# EAGLE design servopoinB-2 (EAGLE 6.6.0)
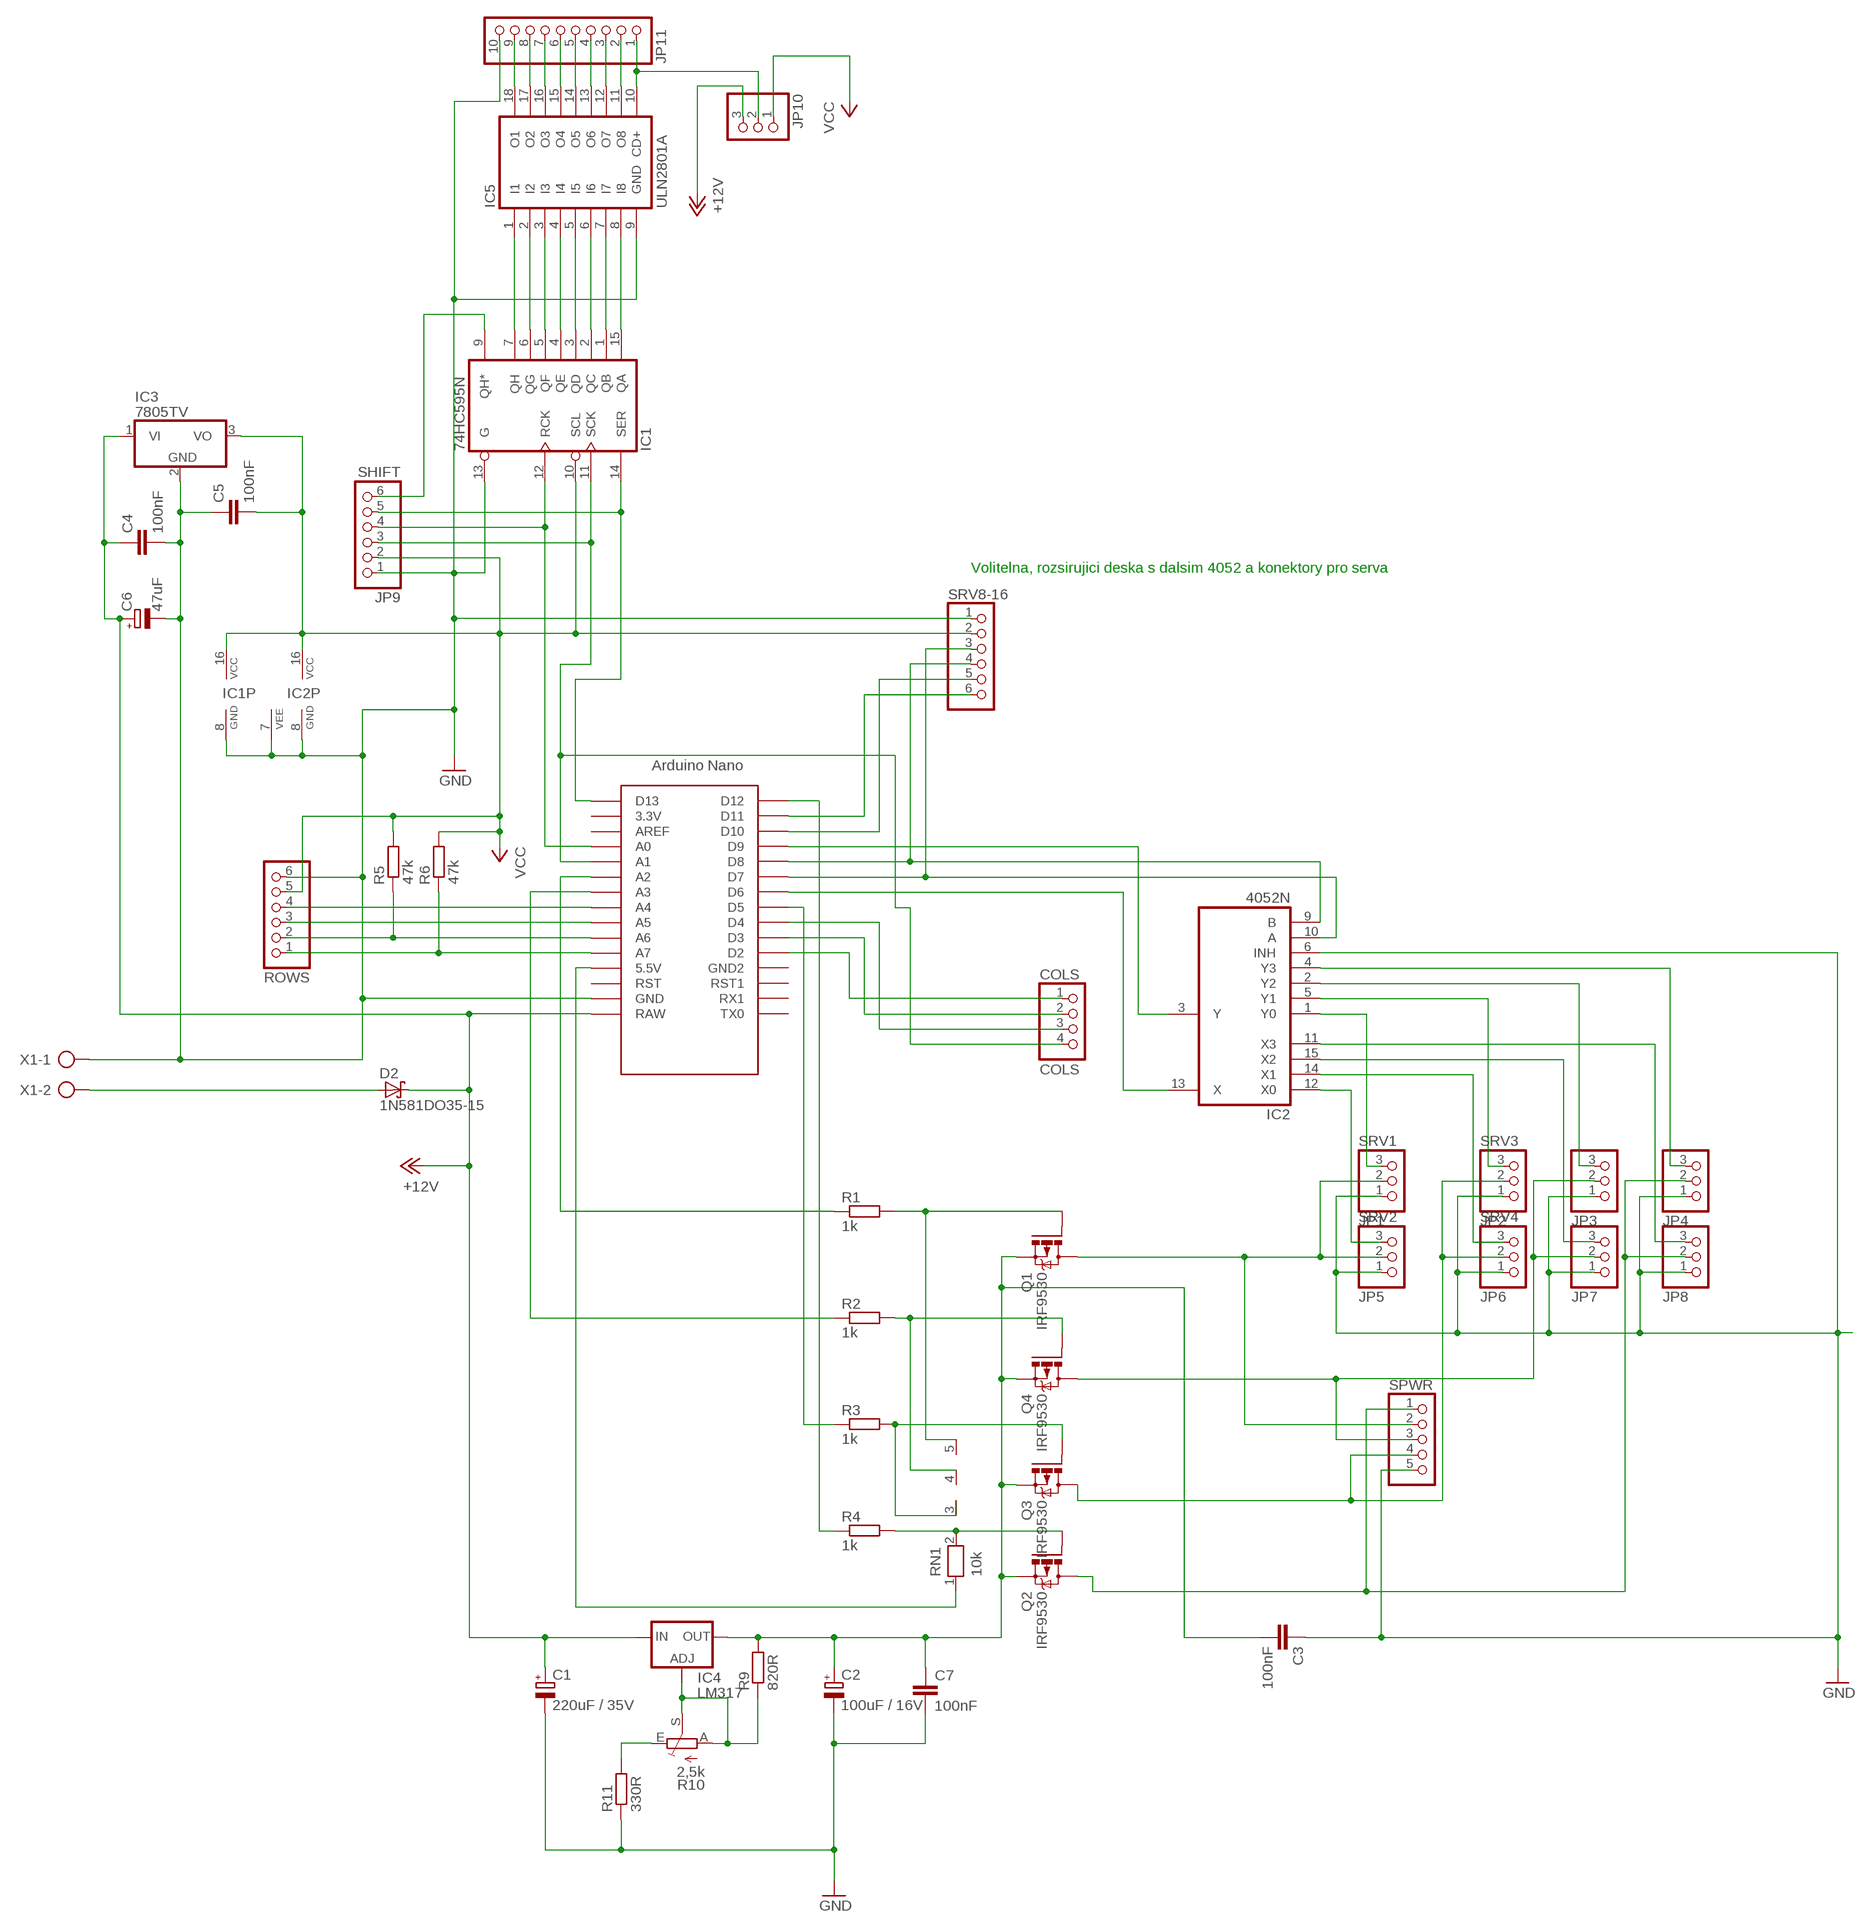
[diagram p0: schematic, sheet 1]

## Parts
C1  220uF / 35V  CPOL-EUE5-10.5  [E5-10,5]
C2  100uF / 16V  CPOL-EUE2.5-5  [E2,5-5]
C3  100nF  C-EU025-025X050  [C025-025X050]
C4  100nF  C-EU025-025X050  [C025-025X050]
C5  100nF  C-EU025-025X050  [C025-025X050]
C6  47uF  CPOL-EUE2.5-6  [E2,5-6]
C7  100nF  C-EU025-025X050  [C025-025X050]
COLS  COLS  PINHD-1X4  [1X04]
D2  1N581DO35-15  [DO35-10]
IC1  74HC595N  [DIL16]
IC2  4052N  [DIL16]
IC3  7805TV  [TO220V]
IC4  LM317  LM317TS  [317TS]
IC5  ULN2801A  [DIL18]
JP1  SRV1  PINHD-1X3  [1X03]
JP2  SRV3  PINHD-1X3  [1X03]
JP3  PINHD-1X3  [1X03]
JP4  PINHD-1X3  [1X03]
JP5  SRV2  PINHD-1X3  [1X03]
JP6  SRV4  PINHD-1X3  [1X03]
JP7  PINHD-1X3  [1X03]
JP8  PINHD-1X3  [1X03]
JP9  SHIFT  PINHD-1X6  [1X06]
JP10  PINHD-1X3  [1X03]
JP11  PINHD-1X10  [1X10]
Q1  IRF9530  [TO220BV]
Q2  IRF9530  [TO220BV]
Q3  IRF9530  [TO220BV]
Q4  IRF9530  [TO220BV]
R1  1k  R-EU_0207/10  [0207/10]
R2  1k  R-EU_0207/10  [0207/10]
R3  1k  R-EU_0207/10  [0207/10]
R4  1k  R-EU_0207/10  [0207/10]
R5  47k  R-EU_0207/10  [0207/10]
R6  47k  R-EU_0207/10  [0207/10]
R9  820R  R-EU_0207/10  [0207/10]
R10  2,5k  TRIM_EU-LI10-PADS  [LI10]
R11  330R  R-EU_0207/10  [0207/10]
RN1  10k  RN04  [RN-5]
ROWS  PINHD-1X6  [1X06]
SPWR  PINHD-1X5  [1X05]
SRV8-16  PINHD-1X6  [1X06]
U$1  NANO  [NANO]
X1  AK500/2  [AK500/2]

## Nets
+12V: C1.+ C4.1 C6.+ D2.C IC3.1(VI) IC4.3(IN) JP10.3 U$1.RAW
GND: C1.- C2.- C3.1 C4.2 C5.1 C6.- C7.2 IC1.8(GND) IC1.13(G) IC2.6(INH) IC2.7(VEE) IC2.8(GND) IC3.2(GND) IC5.9(GND) JP1.1 JP2.1 JP3.1 JP4.1 JP5.1 JP6.1 JP7.1 JP8.1 JP9.1 JP11.10 R11.1 ROWS.6 SPWR.5 SRV8-16.1 U$1.GND X1.1
N$1: IC2.13(X) U$1.D6
N$2: IC2.3(Y) U$1.D9
N$3: IC1.15(QA) IC5.8(I8)
N$4: COLS.4 IC1.11(SCK) JP9.3 U$1.A1
N$5: IC2.12(X0) JP5.3
N$6: IC2.1(Y0) JP1.3
N$7: IC2.14(X1) JP6.3
N$8: IC2.5(Y1) JP2.3
N$9: IC2.15(X2) JP7.3
N$10: IC2.2(Y2) JP3.3
N$11: IC2.11(X3) JP8.3
N$12: IC2.4(Y3) JP4.3
N$13: Q1.G R1.2 RN1.5
N$14: JP2.2 JP6.2 Q3.D SPWR.4
N$15: R6.1 ROWS.1 U$1.A7
N$16: R2.1 U$1.A3
N$17: Q4.G R2.2 RN1.4
N$18: R3.1 U$1.D5
N$19: Q3.G R3.2 RN1.3
N$20: RN1.1 U$1.5V(5.5V)
N$21: Q2.G R4.2 RN1.2
N$22: JP3.2 JP7.2 Q4.D SPWR.3
N$23: R4.1 U$1.D12
N$24: R1.1 U$1.A2
N$25: D2.A X1.2
N$26: ROWS.4 U$1.A4
N$27: ROWS.3 U$1.A5
N$28: R5.1 ROWS.2 U$1.A6
N$30: SRV8-16.6 U$1.D11
N$31: COLS.2 U$1.D3
N$32: COLS.3 U$1.D4
N$33: COLS.1 U$1.D2
N$34: SRV8-16.5 U$1.D10
N$35: IC1.14(SER) JP9.5 U$1.D13
N$36: IC1.1(QB) IC5.7(I7)
N$37: IC1.9(QH*) JP9.6
N$38: IC1.12(RCK) JP9.4 U$1.A0
N$39: C2.+ C3.2 C7.1 IC4.2(OUT) Q1.S Q2.S Q3.S Q4.S R9.2
N$40: IC5.10(CD+) JP10.2 JP11.1
N$41: IC1.2(QC) IC5.6(I6)
N$42: IC1.3(QD) IC5.5(I5)
N$43: IC1.4(QE) IC5.4(I4)
N$44: IC1.5(QF) IC5.3(I3)
N$45: IC1.6(QG) IC5.2(I2)
N$46: IC1.7(QH) IC5.1(I1)
N$47: IC5.18(O1) JP11.9
N$49: IC4.1(ADJ) R9.1 R10.A R10.S
N$50: R10.E R11.2
N$51: IC5.17(O2) JP11.8
N$53: JP1.2 JP5.2 Q1.D SPWR.2
N$57: IC5.16(O3) JP11.7
N$58: JP4.2 JP8.2 Q2.D SPWR.1
N$59: IC5.15(O4) JP11.6
N$60: IC5.14(O5) JP11.5
N$61: IC5.13(O6) JP11.4
N$62: IC5.12(O7) JP11.3
N$63: IC5.11(O8) JP11.2
N$64: IC2.9(B) SRV8-16.4 U$1.D8
N$65: IC2.10(A) SRV8-16.3 U$1.D7
VCC: C5.2 IC1.10(SCL) IC1.16(VCC) IC2.16(VCC) IC3.3(VO) JP9.2 JP10.1 R5.2 R6.2 ROWS.5 SRV8-16.2
Unconnected: U$1.3.3V U$1.AREF U$1.GND1(GND2) U$1.ICSP1 U$1.ICSP2 U$1.ICSP3 U$1.ICSP4 U$1.ICSP5 U$1.ICSP6 U$1.RST U$1.RST1 U$1.RX1 U$1.TX0

## Notes on the sheet
- Volitelna, rozsirujici deska s dalsim 4052 a konektory pro serva

## Library data of the parts
C1 C2 = resistor:CPOL-EU: POLARIZED CAPACITOR, European symbol
C3 C7 = resistor:C-EU: CAPACITOR, European symbol
C4 C5 = rcl:C-EU: CAPACITOR, European symbol
C6 = rcl:CPOL-EU: POLARIZED CAPACITOR, European symbol
COLS = pinhead:PINHD-1X4: PIN HEADER
D2 = custom:1N581*: 1.0A SCHOTTKY BARRIER RECTIFIER Source: http://www.diodes.com/datasheets/ds23001.pdf
IC1 = 74xx-eu:74*595: 8-bit SHIFT REGISTER, output latch
IC2 = 40xx:4052: Dual 4-channel ANALOG MULTIPLEXER
IC3 = linear:78*: Positive VOLTAGE REGULATOR Source: http://cache.national.com/ds/LM/LM78L05.pdf http://www.fairchildsemi.com/ds/LM/LM7805.pdf
IC4 = v-reg:LM317TS: VOLTAGE REGULATOR
IC5 = uln-udn:ULN2801A: DRIVER ARRAY
JP1-JP8 JP10 = pinhead:PINHD-1X3: PIN HEADER
JP9 ROWS SRV8-16 = pinhead:PINHD-1X6: PIN HEADER
JP11 = pinhead:PINHD-1X10: PIN HEADER
Q1-Q4 = transistor-power:IRF9530: P-CHANNEL HEXFET POWER-MOS-FET Source: http://www.irf.com/product-info/datasheets/data/irf9530.pdf
R1-R6 R9 R11 = resistor:R-EU_: RESISTOR, European symbol
R10 = custom:TRIM_EU-: POTENTIOMETER
RN1 = resistor-net:RN04: RESISTOR NETWORK; OC_FARNELL: unknown; OC_NEWARK: unknown
SPWR = pinhead:PINHD-1X5: PIN HEADER
U$1 = Arduino-clone:NANO: Arduino Nano
X1 = con-ptr500:AK500/2: CONNECTOR; OC_FARNELL: unknown; OC_NEWARK: unknown

## Board
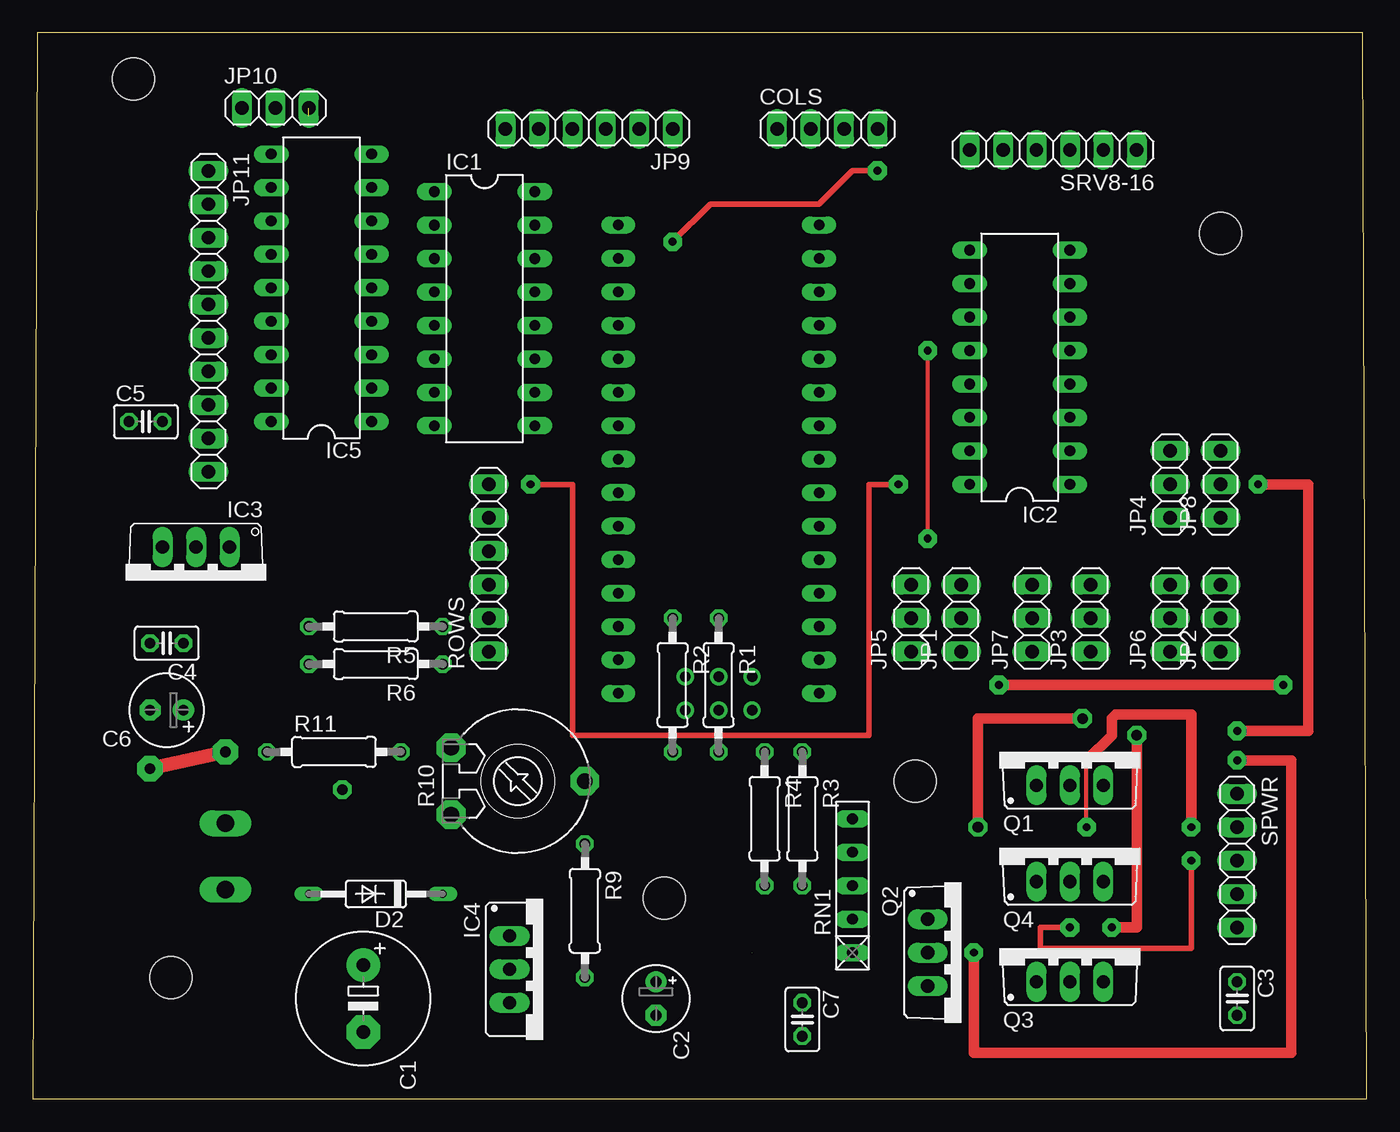
[diagram p1: board, top side]
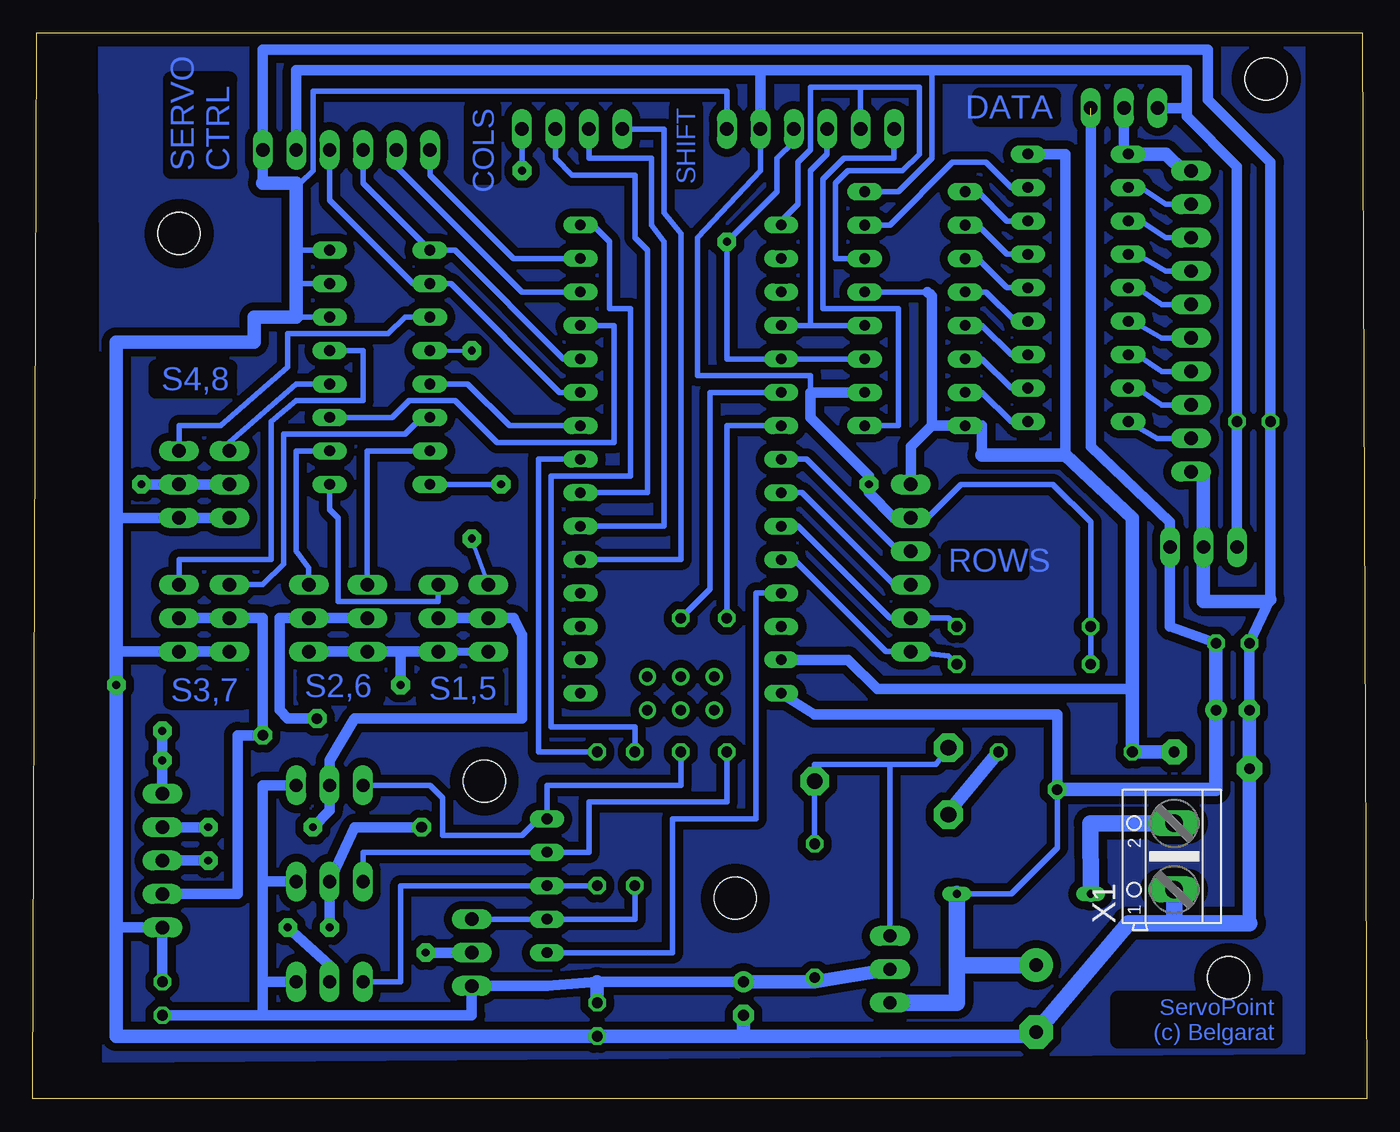
[diagram p2: board, bottom side, seen from below]

Size 101.27 x 80.95 mm. Coordinates in mm from the lower left corner, seen from the top.
Outline: 0,0 101.27,0 100.97,80.95 0.32,80.95 0,0
Copper layers (1*16): Top 0.035mm / dielectric 1.5mm / Bottom 0.035mm
Design rules "default *": minimum track width 10mil, minimum drill 0.6mm, track to track 8mil, track to pad 8mil, pad to pad 8mil, via to via 8mil, smd to smd 8mil, copper to edge 40mil, drill to drill 8mil, minimum pad ring 10mil, minimum via ring 8mil, stop-mask expansion 4mil, vias tented up to drill 0mil, thermal gap 10mil
Holes 3.2 mm at 90.17,65.72 7.62,77.47 10.48,9.21 47.94,15.24 66.99,24.13

### Footprints (pad centres in the part's own frame; a part is rotated, then mirrored left to right if it is on the bottom)
E5-10,5 = drill 1.016 pad 2.54: + -2.54,0 | drill 1.016 pad 2.54 octagon: - 2.54,0
E2,5-5 = drill 0.813 pad 1.6: + -1.27,0 | drill 0.813 pad 1.6 octagon: - 1.27,0
C025-025X050 = drill 0.813 octagon: 1 -1.27,0; 2 1.27,0
E2,5-6 = drill 0.813 pad 1.6: + -1.27,0 | drill 0.813 pad 1.6 octagon: - 1.27,0
1X04 = drill 1.016 long: 1 -3.81,0; 2 -1.27,0; 3 1.27,0; 4 3.81,0
DO35-10 = drill 0.6 long: A 5.08,0; C -5.08,0
DIL16 = drill 0.813 long: 1 -8.89,-3.81; 2 -6.35,-3.81; 3 -3.81,-3.81; 4 -1.27,-3.81; 5 1.27,-3.81; 6 3.81,-3.81; 7 6.35,-3.81; 8 8.89,-3.81; 9 8.89,3.81; 10 6.35,3.81; 11 3.81,3.81; 12 1.27,3.81; 13 -1.27,3.81; 14 -3.81,3.81; 15 -6.35,3.81; 16 -8.89,3.81
TO220V = drill 1.016 long: 1 -2.54,-2.54; 2 0,-2.54; 3 2.54,-2.54
317TS = drill 1.016 long: 1 -2.54,-2.54; 2 0,-2.54; 3 2.54,-2.54
DIL18 = drill 0.813 long: 1 -10.16,-3.81; 2 -7.62,-3.81; 3 -5.08,-3.81; 4 -2.54,-3.81; 5 0,-3.81; 6 2.54,-3.81; 7 5.08,-3.81; 8 7.62,-3.81; 9 10.16,-3.81; 10 10.16,3.81; 11 7.62,3.81; 12 5.08,3.81; 13 2.54,3.81; 14 0,3.81; 15 -2.54,3.81; 16 -5.08,3.81; 17 -7.62,3.81; 18 -10.16,3.81
1X03 = drill 1.016 long: 1 -2.54,0; 2 0,0; 3 2.54,0
1X06 = drill 1.016 long: 1 -6.35,0; 2 -3.81,0; 3 -1.27,0; 4 1.27,0; 5 3.81,0; 6 6.35,0
1X10 = drill 1.016 long: 1 -11.43,0; 2 -8.89,0; 3 -6.35,0; 4 -3.81,0; 5 -1.27,0; 6 1.27,0; 7 3.81,0; 8 6.35,0; 9 8.89,0; 10 11.43,0
TO220BV = drill 1.016 long: D 0,-2.54; G -2.54,-2.54; S 2.54,-2.54
0207/10 = drill 0.813 octagon: 1 -5.08,0; 2 5.08,0
LI10 = drill 1.2 pad 2.184 octagon: A -2.54,-5.08; E 2.54,-5.08; S 0,5.08
RN-5 = drill 0.813 long: 1 -5.08,0; 2 -2.54,0; 3 0,0; 4 2.54,0; 5 5.08,0
1X05 = drill 1.016 long: 1 -5.08,0; 2 -2.54,0; 3 0,0; 4 2.54,0; 5 5.08,0
NANO = drill 0.8 long: 3.3V -10.16,24.13; 5V -10.16,-1.27; A0 -10.16,19.05; A1 -10.16,16.51; A2 -10.16,13.97; A3 -10.16,11.43; A4 -10.16,8.89; A5 -10.16,6.35; A6 -10.16,3.81; A7 -10.16,1.27; AREF -10.16,21.59; D2 5.08,1.27; D3 5.08,3.81; D4 5.08,6.35; D5 5.08,8.89; D6 5.08,11.43; D7 5.08,13.97; D8 5.08,16.51; D9 5.08,19.05; D10 5.08,21.59; D11 5.08,24.13; D12 5.08,26.67; D13 -10.16,26.67; GND -10.16,-6.35; GND1 5.08,-1.27; RAW -10.16,-8.89; RST -10.16,-3.81; RST1 5.08,-3.81; RX1 5.08,-6.35; TX0 5.08,-8.89 | drill 0.8: ICSP1 -5.08,-10.16; ICSP2 -5.08,-7.62; ICSP3 -2.54,-10.16; ICSP4 -2.54,-7.62; ICSP5 0,-10.16; ICSP6 0,-7.62
AK500/2 = drill 1.321 long: 1 -2.515,0; 2 2.515,0

### Placement (x,y rotation side)
C1  25.08,7.62 270 top
C2  47.31,7.62 270 top
C3  91.44,7.62 270 top
C4  10.16,34.61 180 top
C5  8.57,51.44 0 top
C6  10.16,29.53 180 top
C7  58.42,6.03 270 top
COLS  60.33,73.66 0 top
D2  26.04,15.56 180 top
IC1  34.29,60.01 270 top
IC2  74.93,55.56 90 top
IC3  12.38,39.37 180 top
IC4  38.74,9.84 270 top
IC5  21.91,61.59 90 top
JP1  70.48,36.51 90 top
JP2  90.17,36.51 90 top
JP3  80.33,36.51 90 top
JP4  86.36,46.67 90 top
JP5  66.67,36.51 90 top
JP6  86.36,36.51 90 top
JP7  75.88,36.51 90 top
JP8  90.17,46.67 90 top
JP9  42.23,73.66 180 top
JP10  18.41,75.25 0 top
JP11  13.33,59.05 270 top
Q1  78.74,26.35 0 top
Q2  70.48,11.11 270 top
Q3  78.74,11.43 0 top
Q4  78.74,19.05 0 top
R1  52.07,31.43 270 top
R2  48.58,31.43 270 top
R3  58.42,21.27 270 top
R4  55.56,21.27 270 top
R5  26.04,35.88 180 top
R6  26.04,33.02 180 top
R9  41.91,14.29 270 top
R10  36.83,24.13 270 top
R11  22.86,26.35 0 top
RN1  62.23,16.19 90 top
ROWS  34.61,40.32 90 top
SPWR  91.44,18.1 270 top
SRV8-16  77.47,72.07 180 top
U$1  54.61,39.69 0 top
X1  14.61,18.41 90 bottom

### Tracks (layer width: path | path; a pad name or v marks a point on that pad's centre or on a via)
+12V  (via drill 0.8 pad 1.42)  (1 unrouted)
  Bottom 0.406: v23.5,23.5 23.5,19.05 26.99,15.56 D2.C
  Bottom 0.813: C4.1 14.92,35.88 IC3.1 14.92,43.81 20.95,49.53 20.95,74.61 | v23.5,23.5 23.5,29.21 41.91,29.21 U$1.RAW
  Bottom 1.016: C4.1 C6.+ 11.43,23.5 v23.5,23.5
  Bottom 1.27: C1.+ 31.11,10.16 | 31.11,10.16 D2.C | 31.11,10.16 31.11,7.3 IC4.3
AAA
  pour Bottom (isolate 0.61): 4.76,80.96 96.2,81.28 95.88,2.86 4.76,3.49
GND  (via drill 0.6 pad 1.42, 0.8 pad 1.93)
  Top 0.813: v94.93,31.43 v73.34,31.43
  Top 1.016: v14.61,26.35 v8.89,25.08
  Bottom 0.406: IC1.8 29.21,51.12 | IC2.8 81.28,64.45 | 81.28,59.37 IC2.6 | 33.02,61.28 33.34,61.28 IC1.13 | IC2.7 80.96,61.91 81.28,62.23 | 81.28,69.53 80.96,69.53 80.01,70.48 80.01,76.52 48.58,76.52 JP9.1 | 29.21,48.9 29.53,48.9
  Bottom 0.61: JP1.1 JP5.1
  Bottom 0.813: JP1.1 73.34,33.97 | 73.34,33.97 JP7.1 JP3.1 | JP6.1 JP2.1 94.93,33.97 | JP4.1 JP8.1 94.93,44.13 | 94.93,13.02 SPWR.5 C3.1 | IC2.6 79.38,59.37 | 83.82,69.53 SRV8-16.1 83.82,79.69 12.06,79.69 12.06,75.88 7.3,71.12 C5.1 7.3,38.1 7.35,37.93 C4.2 C6.- | 29.21,51.12 29.21,48.9 | IC1.8 33.02,51.12 | 33.02,51.12 33.02,60.96 33.34,61.28 | 22.86,48.9 22.86,71.75 IC5.9 26.35,71.75 | U$1.GND 39.37,33.34 37.15,31.11 18.1,31.11 17.78,30.8 R11.1 | ROWS.6 34.61,49.53 33.02,51.12 | 73.34,33.97 v73.34,31.43
  Bottom 1.016: C6.- v8.89,25.08 8.89,13.34 | 83.82,69.53 81.28,69.53 81.28,64.45 81.28,62.23 81.28,59.37 84.45,59.37 84.45,57.47 94.93,57.47 94.93,44.13 94.93,33.97 v94.93,31.43 94.93,13.02 94.93,4.76 C7.2 47.31,4.76 | C2.- 47.31,4.76 | C1.- 24.77,4.76 47.31,4.76 | JP11.10 12.38,47.62 IC3.2 12.38,37.78 7.5,37.78 7.35,37.93 | v14.61,26.35 R11.1 17.78,44.13 22.86,48.9 29.21,48.9
  Bottom 1.27: 8.89,13.34 14.58,13.34 | 14.58,13.34 X1.1 | 14.58,13.34 18.1,13.34 C1.-
N$1
  Bottom 0.406: U$1.D6 65.09,51.12 68.26,54.29 IC2.13
N$2
  Bottom 0.406: U$1.D9 57.15,58.74 57.15,49.85 66.04,49.85 69.21,53.02 72.71,53.02 73.98,51.75 IC2.3
N$3
  Bottom 0.406: IC1.15 36.2,66.36 31.43,71.12 28.89,71.12 26.99,69.22 IC5.8
N$4  (via drill 0.6 pad 1.42)
  Top 0.406: v64.14,70.48 62.23,70.48 59.69,67.94 51.44,67.94 v48.58,65.09
  Bottom 0.406: IC1.11 U$1.A1 48.58,56.2 v48.58,65.09 44.77,68.9 44.77,71.44 43.5,72.71 JP9.3 | COLS.4 v64.14,70.48
N$5  (via drill 0.6 pad 1.42)
  Top 0.305: v67.94,42.55 v67.94,56.83
  Bottom 0.305: JP5.3 v67.94,42.55 | IC2.12 v67.94,56.83
N$6
  Bottom 0.406: JP1.3 70.48,37.78 78.1,37.78 78.1,44.13 78.74,44.77 IC2.1
N$7
  Bottom 0.406: IC2.14 71.44,51.44 72.07,51.44 73.02,50.48 82.23,50.48 82.23,40.64 83.82,39.05 JP6.3
N$8
  Bottom 0.406: IC2.5 76.2,56.83 76.2,53.02 81.28,53.02 83.19,51.44 83.19,40.96 90.17,40.96 JP2.3
N$9
  Bottom 0.406: IC2.15 75.88,49.21 JP7.3
N$10
  Bottom 0.406: IC2.2 81.28,49.21 81.28,41.59 80.33,40.32 JP3.3
N$11
  Bottom 0.406: JP8.3 90.17,51.12 86.99,51.12 81.91,55.56 81.91,58.1 74.3,58.1 73.02,59.37 IC2.11
N$12
  Bottom 0.406: IC2.4 81.28,54.29 86.36,49.85 JP4.3
N$13
  Bottom 0.406: R1.2 52.07,23.81 62.23,23.81 RN1.5 62.87,21.27 64.14,20 70.17,20 70.17,22.86 71.12,23.81 Q1.G
N$14  (via drill 0.6 pad 1.42, 0.8 pad 1.42)
  Top 0.813: v81.91,13.02 83.82,13.02 v83.82,27.62
  Bottom 0.406: 84.45,27.62 v83.82,27.62
  Bottom 0.813: JP2.2 JP6.2 83.82,36.51 v83.82,27.62 | SPWR.4 85.72,15.56 85.72,27.62 84.45,27.62 | Q3.D 78.74,10.16 v81.91,13.02
N$15
  Bottom 0.406: R6.1 31.75,33.66 ROWS.1 36.51,33.97 43.5,40.96 U$1.A7
N$16
  Bottom 0.406: R2.1 48.58,51.12 U$1.A3
N$17
  Bottom 0.406: R2.2 48.58,22.54 59.05,22.54 59.05,18.73 RN1.4 76.2,18.73 Q4.G
N$18
  Bottom 0.406: R3.1 62.87,26.35 62.87,48.58 U$1.D5
N$19
  Bottom 0.406: Q3.G 73.34,8.89 73.34,16.19 RN1.3 R3.2
N$20
  Bottom 0.406: RN1.1 52.71,11.11 52.71,21.27 46.36,21.27 46.36,38.42 U$1.5V
N$21
  Bottom 0.406: Q2.G RN1.2 55.56,13.65 R4.2
N$22  (via drill 0.6 pad 1.42, 0.8 pad 1.42)
  Top 0.406: v87.95,18.1 87.95,11.43 76.52,11.43 76.52,13.02 v78.74,13.02
  Top 0.813: v79.69,28.89 71.75,28.89 v71.75,20.64
  Bottom 0.813: v71.75,20.64 76.83,20.64 Q4.D v78.74,13.02 | JP7.2 JP3.2 82.55,36.51 82.55,29.53 81.91,28.89 v79.69,28.89 | SPWR.3 v87.95,18.1
N$23
  Bottom 0.406: U$1.D12 58.74,66.36 57.47,65.09 57.47,60.01 55.88,60.01 55.88,47.31 61.91,47.31 61.91,28.26 55.56,28.26 R4.1
N$24
  Bottom 0.406: U$1.A2 49.85,53.66 49.85,38.73 R1.1
N$25
  Bottom 1.27: X1.2 20.98,20.93 D2.A
N$26
  Bottom 0.406: ROWS.4 35.56,41.59 42.55,48.58 U$1.A4
N$27
  Bottom 0.406: ROWS.3 35.88,39.05 42.86,46.04 U$1.A5
N$28
  Bottom 0.406: R5.1 31.75,36.51 ROWS.2 36.2,36.51 43.18,43.5 U$1.A6
N$30
  Bottom 0.406: U$1.D11 64.77,63.82 71.12,70.17 SRV8-16.6
N$31
  Bottom 0.406: COLS.2 59.05,71.44 54.29,71.44 54.29,66.36 53.34,65.09 53.34,43.5 U$1.D3
N$32
  Bottom 0.406: COLS.3 61.6,71.44 60.33,70.17 55.56,70.17 55.56,65.41 54.61,64.45 54.61,46.04 U$1.D4
N$33
  Bottom 0.406: COLS.1 53.34,73.66 53.34,67.31 52.07,65.72 52.07,40.96 U$1.D2
N$34
  Bottom 0.406: U$1.D10 64.14,61.28 73.66,70.8 SRV8-16.5
N$35
  Bottom 0.406: JP9.5 38.42,76.83 | 38.42,76.83 33.97,76.83 33.97,71.75 35.24,70.48 39.37,70.48 40.32,69.53 40.32,63.82 IC1.14 | 38.42,76.83 42.23,76.83 42.23,72.07 43.18,71.12 43.18,67.94 44.45,66.67 U$1.D13
N$36
  Bottom 0.406: IC1.1 29.53,68.9 27.3,66.67 IC5.7
N$37
  Bottom 0.406: JP9.6 35.88,71.44 39.69,71.44 41.28,69.85 41.28,60.01 35.56,60.01 35.56,51.12 IC1.9
N$38
  Bottom 0.406: U$1.A0 42.23,58.74 | 42.23,58.74 IC1.12 | 42.23,58.74 42.23,70.48 40.96,71.75 JP9.4
N$39
  Bottom 0.406: R9.2 41.91,8.89
  Bottom 0.813: Q1.S 83.82,23.81 83.82,16.51 | 83.82,16.51 83.82,8.89 | 83.82,8.89 83.82,6.35 | 83.82,6.35 67.94,6.35 Q2.S 62.23,8.57 58.42,8.89 C2.+ | Q3.S 83.82,8.89 | Q4.S 83.82,16.51 | C3.2 83.82,6.35
  Bottom 1.016: IC4.2 41.91,8.89 C2.+ | C7.1 58.42,8.89
N$40
  Bottom 0.813: JP10.2 18.41,72.07 IC5.10
  Bottom 1.016: JP11.1 13.97,70.48 15.24,71.75 IC5.10
N$41
  Bottom 0.406: IC1.2 29.53,66.36 27.3,64.14 IC5.6
N$42
  Bottom 0.406: IC1.3 29.53,63.82 27.3,61.59 IC5.5
N$43
  Bottom 0.406: IC1.4 28.89,61.28 26.67,59.05 IC5.4
N$44
  Bottom 0.406: IC1.5 29.21,58.74 26.99,56.52 IC5.3
N$45
  Bottom 0.406: IC1.6 29.21,56.2 26.99,53.98 IC5.2
N$46
  Bottom 0.406: IC1.7 29.21,53.66 26.99,51.44 IC5.1
N$47
  Bottom 0.406: JP11.9 15.88,50.16 IC5.18
N$48  (1 unrouted)
N$49
  Bottom 0.406: R9.1 R10.S 41.91,25.4 36.2,25.4 | IC4.1 36.2,25.4 | 36.2,25.4 32.7,25.4 R10.A
N$50
  Bottom 1.016: R11.2 31.11,22.54 R10.E
N$51
  Bottom 0.406: IC5.17 17.46,53.98 15.56,52.7 13.65,52.7 JP11.8
N$53  (via drill 0.6 pad 1.42)
  Top 0.305: v80.01,20.64 80.01,25.72
  Top 0.813: v87.95,20.64 87.95,29.21 82.23,29.21 81.91,28.89 81.91,27.62 80.01,25.72
  Bottom 0.813: JP1.2 JP5.2 64.77,36.51 64.14,35.24 64.14,28.89 76.83,28.89 78.74,25.72 Q1.D 78.74,21.91 v80.01,20.64 | SPWR.2 v87.95,20.64
N$57
  Bottom 0.406: IC5.16 17.46,56.52 15.56,55.24 JP11.7
N$58  (via drill 0.6 pad 1.42)
  Top 0.813: v91.44,25.72 95.57,25.72 95.57,3.49 71.44,3.49 v71.44,11.11 | v91.44,27.94 96.84,27.94 96.84,46.67 v93.03,46.67
  Bottom 0.813: JP4.2 JP8.2 v93.03,46.67 | Q2.D v71.44,11.11 | SPWR.1 v91.44,25.72 v91.44,27.94
N$59
  Bottom 0.406: IC5.15 17.78,59.05 15.56,57.78 JP11.6
N$60
  Bottom 0.406: IC5.14 17.46,61.59 15.56,60.33 JP11.5
N$61
  Bottom 0.406: IC5.13 17.46,64.14 15.24,62.87 JP11.4
N$62
  Bottom 0.406: IC5.12 17.14,66.67 15.24,65.41 JP11.3
N$63
  Bottom 0.406: IC5.11 17.14,69.22 15.24,67.94 JP11.2
N$64
  Bottom 0.406: SRV8-16.4 76.2,69.53 IC2.9 69.21,64.45 60.96,56.2 U$1.D8
N$65
  Bottom 0.406: SRV8-16.3 78.74,68.26 72.39,61.91 IC2.10 69.53,61.91 61.28,53.66 U$1.D7
VCC  (via drill 0.6 pad 1.42)
  Top 0.406: v65.72,46.67 63.5,46.67 63.5,27.62 40.96,27.62 40.96,46.67 v37.78,46.67
  Bottom 0.406: JP9.2 46.04,70.48 50.8,65.41 50.8,54.93 42.23,54.93 42.23,53.66 | 71.75,46.67 IC2.16 v65.72,46.67 | IC1.16 35.56,68.9 33.02,71.44 33.02,78.11 | 9.84,70.48 9.84,69.85 | R6.2 R5.2 20.95,43.81 23.81,46.67 30.8,46.67 33.34,44.13 ROWS.5 35.88,44.13
  Bottom 0.813: IC1.10 42.23,53.66 42.23,51.75 37.78,47.31 v37.78,46.67 37.78,46.04 35.88,44.13 | 46.04,78.11 JP9.2 | SRV8-16.2 81.28,78.11 46.04,78.11 | 13.65,75.56 13.65,74.61 9.84,70.8 9.84,70.48 C5.2 IC3.3 | 13.65,75.56 13.65,78.11 33.02,78.11 46.04,78.11 | JP10.1 13.97,75.25 13.65,75.56

### Text on the board
Bottom: DATA | SHIFT | COLS | SERVO / CTRL | S4,8 | ROWS | S1,5 | S2,6 | S3,7 | ServoPoint / (c) Belgarat